# Altium schematic sheet Industrial Radio.SchDoc
size B; SheetNumber: 1; SheetTotal: 1
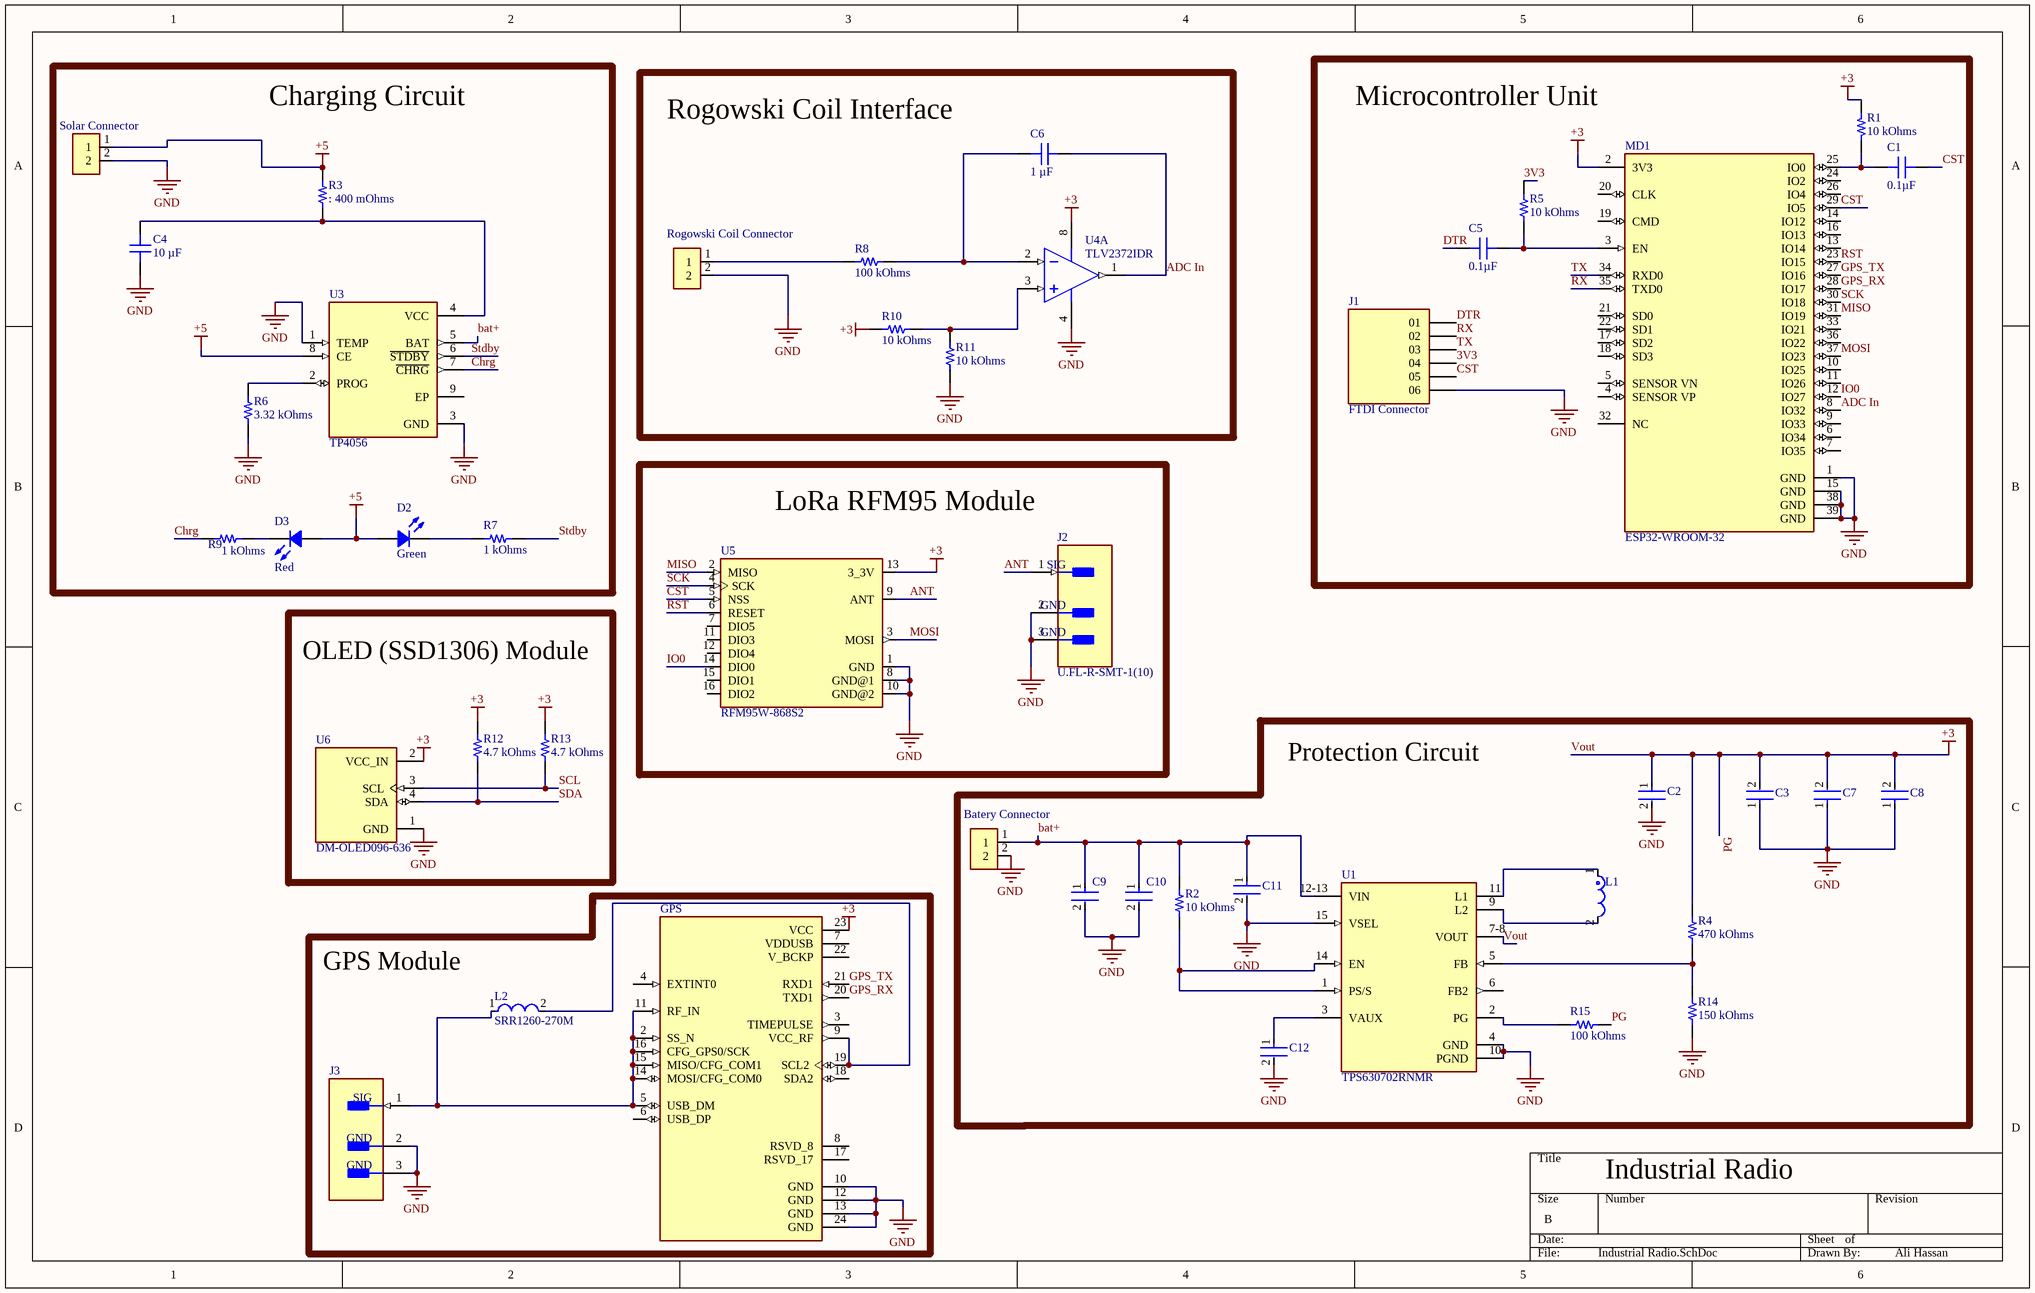
[diagram p0: Industrial Radio.SchDoc]

## Parts
Batery_Connector  B2B-PH-SM4-TB(LF)(SN)  [B2B-PH-SM4-TB(LF)(SN)]  (value not drawn)
C1  0.1µF  [CAP 0603_1608]
C2  TMK107BBJ106MA-T  [FP-0603-L_1_6_0_2-W_0_8_0-MFG]  (value not drawn)
C3  GRM21BC81C226ME44L  [FP-GRM21B-0_2-e0_2_0_7-MFG]  (value not drawn)
C4  10 µF  [MURATA GRM188 0603_1608]
C5  0.1µF  [CAP 0603_1608]
C6  1 µF  [CAP 0603_1608]
C7  GRM21BC81C226ME44L  [FP-GRM21B-0_2-e0_2_0_7-MFG]  (value not drawn)
C8  GRM21BC81C226ME44L  [FP-GRM21B-0_2-e0_2_0_7-MFG]  (value not drawn)
C9  GRM21BC71E106ME11L  [FP-GRM21B-0_2-e0_2_0_7-IPC_A]  (value not drawn)
C10  GRM21BC71E106ME11L  [FP-GRM21B-0_2-e0_2_0_7-IPC_A]  (value not drawn)
C11  TMK107BBJ106MA-T  [FP-0603-L_1_6_0_2-W_0_8_0-MFG]  (value not drawn)
C12  TMK105B7104MV-FR  [FP-0402-L_1_0_0_05-W_0_5-IPC_B]  (value not drawn)
D2  Green  [LED 1206_3216 GREEN]
D3  Red  [LED 1206_3216 RED]
GPS  NEO-6M-GPS  [XCVR_NEO-6M-GPS]  (value not drawn)
J1  FTDI Connector  [SAMTEC_MTSW-106-09-G-S-375-RA]
J2  U.FL-R-SMT-1(10)  [FP-U_FL-R-SMT-1_10-MFG]
J3  U.FL-R-SMT-1(10)  [FP-U_FL-R-SMT-1_10-MFG]  (value not drawn)
L1  XFL4020-152MEC  [FP-XFL4020-MFG]  (value not drawn)
L2  SRR1260-270M  [FP-SRR1260-MFG]
MD1  ESP32-WROOM-32  [FP-ESP32-WROOM-32-MFG]
R1  10 kOhms  [RES 0603_1608]
R2  10 kOhms  [RES 0603_1608]
R3  (no value)  [YAGEO RES 0603_1608]
R4  470 kOhms  [YAGEO RES 0603_1608]
R5  10 kOhms  [RES 0603_1608]
R6  3.32 kOhms  [RES 0603_1608]
R7  1 kOhms  [RES 0603_1608]
R8  100 kOhms  [RES 0603_1608]
R9  1 kOhms  [RES 0603_1608]
R10  10 kOhms  [RES 0603_1608]
R11  10 kOhms  [RES 0603_1608]
R12  4.7 kOhms  [RES 0603_1608]
R13  4.7 kOhms  [RES 0603_1608]
R14  150 kOhms  [RES 0603_1608]
R15  100 kOhms  [RES 0603_1608]
Rogowski_Coil_Connector  B2B-PH-SM4-TB(LF)(SN)  [B2B-PH-SM4-TB(LF)(SN)]  (value not drawn)
Solar_Connector  B2B-PH-SM4-TB(LF)(SN)  [B2B-PH-SM4-TB(LF)(SN)]  (value not drawn)
U1  TPS630702RNMR  [FP-RNM0015A-MFG]
U3  TP4056  [SOP127P600X175-9N]
U4  TLV2372IDR  [D0008A_M]  (part A of 2)
U5  RFM95W-868S2  [XCVR_RFM95W-868S2]
U6  DM-OLED096-636  [MODULE_DM-OLED096-636]

## Blocks framed on the sheet
Charging Circuit: C4 D2 D3 R3 R6 R7 R9 Solar_Connector U3
Microcontroller Unit: C1 C5 J1 MD1 R1 R5
Rogowski Coil Interface: C6 R8 R10 R11 Rogowski_Coil_Connector U4
LoRa RFM95 Module: J2 U5
OLED (SSD1306) Module: R12 R13 U6
Protection Circuit: Batery_Connector C2 C3 C7-C12 L1 R2 R4 R14 R15 U1

## Nets
+5: D2.1 D3.1 R3.2 Solar_Connector.1 U3.8(CE)
GND: Batery_Connector.2 C2.2 C3.1 C4.1 C7.1 C8.1 C9.2 C10.2 C11.2 C12.2 GPS.10(GND) GPS.12(GND) GPS.13(GND) GPS.24(GND) J1.06 J2.2(GND) J2.3(GND) J3.2(GND) J3.3(GND) MD1.1(GND) MD1.15(GND) MD1.38(GND) MD1.39(GND) R6.1 R11.1 R14.1 Rogowski_Coil_Connector.2 Solar_Connector.2 U1.4(GND) U1.10(PGND) U1.15(VSEL) U3.1(TEMP) U3.3(GND) U4.4(GND) U5.1(GND) U5.8(GND@1) U5.10(GND@2) U6.1(GND)
PG: C2.1 C3.2 C7.2 C8.2 GPS.23(VCC) MD1.2(3V3) R1.2 R4.2 R10.1 R12.1 R13.1 R15.1 U1.7-8(VOUT) U4.8(VDD) U5.13(3_3V) U6.2(VCC_IN)  [also labelled +3, Vout]
3V3: J1.04 R5.2
ADC In: C6.2 MD1.8(IO32) U4.1(OUT1)
ANT: J2.1(SIG) U5.9(ANT)
bat+: Batery_Connector.1 C9.1 C10.1 C11.1 R2.2 U1.12-13(VIN) U3.5(BAT)
Chrg: R9.1 U3.7(~{CHRG})
CST: C1.1 J1.05 MD1.29(IO5) U5.5(NSS)
DTR: C5.1 J1.01
GPS_RX: GPS.20(TXD1) MD1.28(IO17)
GPS_TX: GPS.21(RXD1) MD1.27(IO16)
IO0: MD1.12(IO27) U5.14(DIO0)
MISO: MD1.31(IO19) U5.2(MISO)
MOSI: MD1.37(IO23) U5.3(MOSI)
RST: MD1.23(IO15) U5.6(RESET)
RX: J1.02 MD1.35(TXD0)
SCK: MD1.30(IO18) U5.4(SCK)
SCL: R13.2 U6.3(SCL)
SDA: R12.2 U6.4(SDA)
Stdby: R7.1 U3.6(~{STDBY})
TX: J1.03 MD1.34(RXD0)
NetC1_2: C1.2 MD1.25(IO0) R1.1
NetC4_2: C4.2 R3.1 U3.4(VCC)
NetC5_2: C5.2 MD1.3(EN) R5.1
NetC6_1: C6.1 R8.2 U4.2(IN1-)
NetC12_1: C12.1 U1.3(VAUX)
NetD2_2: D2.2 R7.2
NetD3_2: D3.2 R9.2
NetGPS_2: GPS.2(SS_N) GPS.5(USB_DM) GPS.11(RF_IN) GPS.14(MOSI/CFG_COM0) GPS.15(MISO/CFG_COM1) GPS.16(CFG_GPS0/SCK) J3.1(SIG) L2.1
NetGPS_9: GPS.9(VCC_RF) GPS.19(SCL2) L2.2
NetL1_1: L1.1 U1.11(L1)
NetL1_2: L1.2 U1.9(L2)
NetR2_1: R2.1 U1.1(PS/S) U1.14(EN)
NetR4_1: R4.1 R14.2 U1.5(FB)
NetR6_2: R6.2 U3.2(PROG)
NetR8_1: R8.1 Rogowski_Coil_Connector.1
NetR10_2: R10.2 R11.2 U4.3(IN1+)
NetR15_2: R15.2 U1.2(PG)

Not connected (* = marked no-connect by the designer): GPS 3(TIMEPULSE) 4(EXTINT0) 6(USB_DP) 7(VDDUSB) 8(RSVD_8) 17(RSVD_17) 18(SDA2) 22(V_BCKP); MD1 4(SENSOR_VP) 5(SENSOR_VN) 6(IO34) 7(IO35) 9(IO33) 10(IO25) 11(IO26) 13(IO14) 14(IO12) 16(IO13) 17(SD2) 18(SD3) 19(CMD) 20(CLK) 21(SD0) 22(SD1) 24(IO2) 26(IO4) 32(NC) 33(IO21) 36(IO22); U1 6(FB2); U3 9(EP); U5 7(DIO5) 11(DIO3) 12(DIO4) 15(DIO1) 16(DIO2)

## Notes on the sheet
- (near L2) GPS Module
- Industrial Radio
- Ali Hassan

## Library data of the parts
Batery_Connector Rogowski_Coil_Connector Solar_Connector = B2B-PH-SM4-TB(LF)(SN): Connector Header Surface Mount 2 position 0.079 (2.00mm); MF: JST Sales; SnapEDA_Link: https://www.snapeda.com/parts/B2B-PH-SM4-TB(LF)(SN)/JST+Sales+America+Inc./view-part/?ref=snap; Package: NON STANDARD-2 JST; Value: *; MP: B2B-PH-SM4-TB(LF)(SN); Check_prices: https://www.snapeda.com/parts/B2B-PH-SM4-TB(LF)(SN)/JST+Sales+America+Inc./view-part/?ref=eda
C1 C5 = 06033C104K4T4A: CAP CER 0.1UF 25V X7R 0603; manufacturer: AVX Corporation; Tolerance: ±10%; Part Number: 06033C104K4T4A; Capacitance: 0.1µF; Applications: Automotive; componentlink1description: Datasheet; componentlink1url: http://datasheets.avx.com/AutoMLCC.pdf; componentlink2description: DigiKey Link; componentlink2url: http://digikey.com/product-detail/en/avx-corporation/06033C104K4T4A/478-10673-1-ND/7536544; Device Package: 0603 (1608 Metric); lastupdated: 02/09/2020 1:03:35 am; Lifecycle Status: Active; Minimum Order: 1; Mounting Type: Surface Mount, MLCC; Operating Temperature: -55°C ~ 125°C; Package / Case: 0603 (1608 Metric); packaging: TapeAndReel; partid: 2749; Part Status: Active; price: 0.02; Ratings: AEC-Q200; series: -; Size / Dimension: 0.063" L x 0.032" W (1.60mm x 0.81mm); Supplier 1: DigiKey; Supplier Part Number 1: 478-10673-1-ND; Temperature Coefficient: X7R; Thickness (Max): 0.035" (0.90mm); value: 0.1µF; Voltage - Rated: 25V
C2 C11 = CMP-14477-005164-2: Multilayer Ceramic Capacitor 10uF 25V X5R 20% SMD 0603 T/R; Capacitance: 10uF; Packaging: Tape and Reel; Tolerance: 20%; Mount: Surface Mount; Case Code (Metric): 1608; Case Code (Imperial): 0603; Min Operating Temperature: -55°C; Lead Free: Lead Free; RoHS Compliant: Yes; Case/Package: 0603; Max Operating Temperature: 85°C; Voltage Rating: 25V
C3 C7 C8 = CMP-06035-012913-1: Chip Multilayer Ceramic Capacitors for General Purpose, 0805, 22uF, X6S, 22%, 20%, 16V; Packaging: Tape and Reel; Dielectric: X6S; Case Code (Imperial): 0805; Weight: 0.000335oz; Case Code (Metric): 2012; Thickness: 0.057inch; Min Operating Temperature: -55°C; Voltage Rating (DC): 16V; Tolerance: 20%; Width: 1.25mm; Voltage Rating: 16V; Mount: Surface Mount; Capacitance: 22uF; Length: 0.079inch; Lead Free: Lead Free; Case/Package: 0805; Package Quantity: 3000; Height: 1.25mm; Max Operating Temperature: 105°C; Termination: SMD/SMT
C4 = GRM188C80E106ME47D: CAP CER 10UF 2.5V X6S 0603; manufacturer: Murata Electronics; Tolerance: ±20%; Part Number: GRM188C80E106ME47D; Capacitance: 10 µF; Applications: General Purpose; componentlink1description: Datasheet; componentlink1url: https://www.murata.com/~/media/webrenewal/support/library/catalog/products/capacitor/mlcc/c02e.ashx?la=en-us; componentlink2description: DigiKey Link; componentlink2url: https://www.digikey.com/en/products/detail/murata-electronics/GRM188C80E106ME47D/2612380; Device Package: 0603 (1608 Metric); lastupdated: 20/07/2024 12:23:22 am; Lifecycle Status: Active; Minimum Order: 1; Mounting Type: Surface Mount, MLCC; Operating Temperature: -55°C ~ 105°C; Package / Case: 0603 (1608 Metric); packaging: TapeAndReel; partid: 2395; Part Status: Active; price: 0.03; series: GRM; Size / Dimension: 0.063" L x 0.031" W (1.60mm x 0.80mm); Supplier 1: DigiKey; Supplier Part Number 1: 490-8278-1-ND; Temperature Coefficient: X6S; Thickness (Max): 0.035" (0.90mm); value: 10 µF; Voltage - Rated: 2.5V
C6 = C0603X105M9RACAUTO: CAP CER 1UF 6.3V X7R 0603; manufacturer: KEMET; Tolerance: ±20%; Part Number: C0603X105M9RACAUTO; Capacitance: 1 µF; Applications: Automotive, Boardflex Sensitive; componentlink1description: Datasheet; componentlink1url: https://api.kemet.com/component-edge/download/datasheet/C0603X105M9RACAUTO.pdf; componentlink2description: DigiKey Link; componentlink2url: https://www.digikey.com/en/products/detail/kemet/C0603X105M9RACAUTO/8635848; Device Package: 0603 (1608 Metric); Features: Soft Termination; lastupdated: 09/02/2024 8:10:30 pm; Lifecycle Status: Active; Minimum Order: 1; Mounting Type: Surface Mount, MLCC; Operating Temperature: -55°C ~ 125°C; Package / Case: 0603 (1608 Metric); packaging: TapeAndReel; partid: 2401; Part Status: Active; price: 0.06; Ratings: AEC-Q200; series: SMD Auto X7R Flex; Size / Dimension: 0.063" L x 0.031" W (1.60mm x 0.80mm); Supplier 1: DigiKey; Supplier Part Number 1: 399-17721-1-ND; Temperature Coefficient: X7R; Thickness (Max): 0.037" (0.95mm); value: 1 µF; Voltage - Rated: 6.3V
C9 C10 = CMP-06035-056773-1: Chip Multilayer Ceramic Capacitors for General Purpose, 0805, 10uF, X7S, 22%, 20%, 25V; Case/Package: 0805; Min Operating Temperature: -55°C; Packaging: Tape and Reel; Height: 1.25mm; Thickness: 0.057inch; Weight: 0.000335oz; Termination: SMD/SMT; Capacitance: 10uF; Max Operating Temperature: 125°C; Length: 0.079inch; Dielectric: X7S; Mount: Surface Mount; Voltage Rating (DC): 25V; Case Code (Imperial): 0805; Case Code (Metric): 2012; Voltage Rating: 25V; Tolerance: 20%; Package Quantity: 3000; Width: 0.049inch
C12 = CMP-14477-003834-2: None; Capacitance: 100nF; Voltage Rating: 25V; Tolerance: 20%; Min Operating Temperature: -55°C; Max Operating Temperature: 125°C; Mount: Surface Mount; RoHS Compliant: Yes; Case/Package: 0402; Packaging: Tape and Reel
D2 = HSMQ-C380: LED GREEN SMD; Manufacturer: Broadcom Limited; Configuration: Standard; Current - Test: 20mA; Lens Color: 1.95mm; Lens Size: 1.40mm Dia; Lens Style: Round with Domed Top; Viewing Angle: 15°; Voltage - Forward (Vf) (Typ): 3.4V; Wavelength - Dominant: 528nm; Wavelength - Peak: 521nm; Part Number: HSMQ-C380; Color: Green; ComponentLink1Description: Datasheet; ComponentLink1URL: https://docs.broadcom.com/docs/12380614; ComponentLink2Description: DigiKey Link; ComponentLink2URL: https://www.digikey.com/en/products/detail/broadcom-limited/HSMQ-C380/8509698; Device Package: 1206 (3216 Metric); Height (Max): 1.95mm; LastUpdated: 03/06/2024 7:59:11 pm; Lifecycle Status: Active; Minimum Order: 1; Mounting Type: Surface Mount; Package / Case: 1206 (3216 Metric); Packaging: TapeAndReel; PartId: 567; Part Status: Active; Price: 0.48; Series: -; Size / Dimension: 3.20mm L x 1.60mm W; Supplier 1: DigiKey; Supplier Part Number 1: 516-4361-1-ND; Value: Green
D3 = HSMC-C380: LED RED SMD; Manufacturer: Broadcom Limited; Configuration: Standard; Current - Test: 20mA; Lens Color: 1.95mm; Lens Size: 1.40mm Dia; Lens Style: Round with Domed Top; Viewing Angle: 15°; Voltage - Forward (Vf) (Typ): 2V; Wavelength - Dominant: 630nm; Wavelength - Peak: 643nm; Part Number: HSMC-C380; Color: Red; ComponentLink1Description: Datasheet; ComponentLink1URL: https://docs.broadcom.com/docs/HSMC-C380-DS100; ComponentLink2Description: DigiKey Link; ComponentLink2URL: https://www.digikey.com/en/products/detail/broadcom-limited/HSMC-C380/8509679; Device Package: 1206 (3216 Metric); Height (Max): 1.95mm; LastUpdated: 03/06/2024 8:00:41 pm; Lifecycle Status: Active; Minimum Order: 1; Mounting Type: Surface Mount; Package / Case: 1206 (3216 Metric); Packaging: TapeAndReel; PartId: 196; Part Status: Active; Price: 0.23; Series: -; Size / Dimension: 3.20mm L x 1.60mm W; Supplier 1: DigiKey; Supplier Part Number 1: 516-HSMC-C380CT-ND; Value: Red
GPS = NEO-6M-GPS: GPS Development Tools SparkFun GNSS-RTK Dead Reckoning Breakout - ZED-F9K (Qwiic); MF: u-blox; SnapEDA_Link: https://www.snapeda.com/parts/NEO-6M-GPS/u-blox/view-part/?ref=snap; MP: NEO-6M-GPS; Availability: Not in stock; Price: None; Check_prices: https://www.snapeda.com/parts/NEO-6M-GPS/u-blox/view-part/?ref=eda; Value: *; Package: None
J1 = MTSW-106-09-G-S-375-RA: Connector Header Through Hole, Right Angle 6 position 0.100 (2.54mm); MF: Samtec Inc.; SnapEDA_Link: https://www.snapeda.com/parts/MTSW-106-09-G-S-375-RA/Samtec/view-part/?ref=snap; Package: None; Value: *; MP: MTSW-106-09-G-S-375-RA; Check_prices: https://www.snapeda.com/parts/MTSW-106-09-G-S-375-RA/Samtec/view-part/?ref=eda
J2 J3 = CMP-2000-05152-3: CONN U.FL RCPT STR 50 OHM SMD; Max Frequency: 6GHz; Connector Type: Coaxial; Body Plating: Silver; Body Material: Bronze; Impedance: 50R; Dielectric Material: Polymer; Insulation Resistance: 500MR; Gender: Male; Packaging: Cut Tape; Length: 3mm; Package Quantity: 2500; Termination: Solder; Lead Free: Lead Free; Series: U.FL; Min Operating Temperature: -40°C; Fastening Type: Snap; Contact Material: Brass; Orientation: Straight; Wire/Cable Type: Coaxial; Frequency: 6GHz; Contact Plating: Gold; Depth: 3.1mm; Weight: 0.001764oz; Max Operating Temperature: 90°C; Radiation Hardening: No; REACH SVHC: No SVHC; Mount: Surface Mount; Housing Color: Beige
L1 = CMP-11268-000104-1: Inductor Power Shielded Wirewound 1.5uH 20% 100KHz 9.1A 15.8mOhm DCR 1515 Automotive Embossed Plastic T/R; Core Material: Composite; DC Resistance (DCR): 15.8mR; Saturation Current: 4.1A; Self Resonant Frequency: 59MHz; Tolerance: 20%; Inductance: 1.5uH; Max DC Current: 9.1A; RoHS Compliant: Yes; Max Operating Temperature: 125°C; Length: 4.3mm; Case/Package: SMD/SMT; Mount: Surface Mount; Shielding: Shielded; Min Operating Temperature: -40°C; RMS Current (Irms): 9.1A; Test Frequency: 100kHz; Inductance Tolerance: 20%; REACH SVHC: No SVHC; Packaging: Tape and Reel; Termination: SMD/SMT; Lead Free: Contains Lead; Width: 4.3mm; Series: XFL4020; Height: 2.1mm
L2 = CMP-07248-000018-1: FIXED IND 27UH 3.6A 45 MOHM SMD; Manufacturer: Bourns; Tolerance: 20%; Core Material: Ferrite; Q Factor: 26; Series Resistance: 45mΩ; Saturation Current: 3.3A; Self Resonant Frequency: 12.7MHz; Test Frequency: 2.52MHz; ComponentLink2URL: https://www.bourns.com/docs/product-datasheets/srr1260.pdf?sfvrsn=a4409aa5_15; Mouser Description: Fixed Inductors 27uH 20% SMD 1260; Temperature Range Low: -40°C; Manufacturer Part Number: SRR1260-270M; Temperature Range High: +125°C; ComponentLink2Description: Datasheet; Lead Free: Yes; Device Class L1: Passive Components; Value: 27uH; Height: 6.5mm; Rms Current: 3.6A; Category: Ind; Device Class L2: Inductors; Composition: Wirewound; RoHS: TRUE; Automotive: No; Digikey Description: FIXED IND 27UH 3.6A 45 MOHM SMD; Package: SRR1260; Device Class L3: Fixed Inductors; Inductance: 27uH; Octopart: https://octopart.com/srr1260-270m-bourns-1930921; Temperature: -40°C to +125°C
MD1 = CMP-194065-000008-1: RX TXRX MOD WIFI SURFACE MOUNT; Frequency: 2.5GHz; Sensitivity: -98dBm; Operating Supply Voltage: 3.6V; Data Rate: 150Mbps; Weight: 0.088185oz; Package Quantity: 550; Min Operating Temperature: -40°C; Mount: Surface Mount; Max Operating Temperature: 85°C; Packaging: Cut Tape; Case/Package: SMD/SMT
R1 R5 R10 R11 = CRCW060310K0JNEA: RES SMD 10K OHM 5% 1/10W 0603; Manufacturer: Vishay Dale; Power (Watts): 0.1W, 1/10W; Temperature Coefficient: ±200ppm/°C; Part Number: CRCW060310K0JNEA; Value: 10 kOhms; ComponentLink1Description: Datasheet; ComponentLink1URL: http://www.vishay.com/docs/20035/dcrcwe3.pdf; ComponentLink2Description: DigiKey Link; ComponentLink2URL: https://www.digikey.com/en/products/detail/vishay-dale/CRCW060310K0JNEA/1174253; Composition: Thick Film; Device Package: 0603 (1608 Metric); Features: Automotive AEC-Q200; Height - Seated (Max): 0.020" (0.50mm); LastUpdated: 09/02/2024 8:43:35 pm; Lifecycle Status: Active; Minimum Order: 1; Number of Terminations: 2; Operating Temperature: -55°C ~ 155°C; Package / Case: 0603 (1608 Metric); Packaging: CutTape; PartId: 5216; Part Status: Active; Price: 0.01; Ratings: AEC-Q200; Resistance: 10 kOhms; Series: CRCW; Size / Dimension: 0.063" L x 0.033" W (1.60mm x 0.85mm); Supplier 1: DigiKey; Supplier Part Number 1: 541-10KGCT-ND; Supplier Device Package: 0603; Tolerance: ±5%
R2 = RNCS0603BKE10K0: RES 10K OHM 0.1% 1/16W 0603; Manufacturer: Stackpole Electronics Inc; Power (Watts): 0.063W, 1/16W; Temperature Coefficient: ±25ppm/°C; Part Number: RNCS0603BKE10K0; Value: 10 kOhms; ComponentLink1Description: Datasheet; ComponentLink1URL: https://www.seielect.com/catalog/sei-rncs_rnch.pdf; ComponentLink2Description: DigiKey Link; ComponentLink2URL: https://www.digikey.com/en/products/detail/stackpole-electronics-inc/RNCS0603BKE10K0/1708836; Composition: Thin Film; Device Package: 0603 (1608 Metric); Features: Anti-Corrosive, Automotive AEC-Q200, Moisture Resistant; Height - Seated (Max): 0.022" (0.55mm); LastUpdated: 09/02/2024 8:43:37 pm; Lifecycle Status: Active; Minimum Order: 1; Number of Terminations: 2; Operating Temperature: -55°C ~ 155°C; Package / Case: 0603 (1608 Metric); Packaging: TapeAndReel; PartId: 4838; Part Status: Active; Price: 0.06; Ratings: AEC-Q200; Resistance: 10 kOhms; Series: RNCS; Size / Dimension: 0.061" L x 0.031" W (1.55mm x 0.80mm); Supplier 1: DigiKey; Supplier Part Number 1: RNCS0603BKE10K0CT-ND; Supplier Device Package: 0603; Tolerance: ±0.1%
R3 = RL0603FR-070R4L: RES 0.4 OHM 1% 1/10W 0603; Manufacturer: Yageo; Power (Watts): 0.1W, 1/10W; Resistance: 400 mOhms; Temperature Coefficient: ±800ppm/°C; Part Number: RL0603FR-070R4L; ComponentLink1Description: Datasheet; ComponentLink1URL: http://www.yageo.com/documents/recent/PYu-RL_Group_521_RoHS_L_2.pdf; ComponentLink2Description: DigiKey Link; ComponentLink2URL: https://www.digikey.com/en/products/detail/yageo/RL0603FR-070R4L/3885512; Composition: Thick Film; Device Package: 0603 (1608 Metric); Features: Current Sense; Height - Seated (Max): 0.022" (0.55mm); LastUpdated: 25/07/2024 9:19:17 am; Lifecycle Status: Active; Minimum Order: 1; Number of Terminations: 2; Operating Temperature: -55°C ~ 155°C; Package / Case: 0603 (1608 Metric); Packaging: TapeAndReel; PartId: 24886; Part Status: Active; Price: 0.03; Ratings: AEC-Q200; Series: RL; Size / Dimension: 0.063" L x 0.031" W (1.60mm x 0.80mm); Supplier 1: DigiKey; Supplier Part Number 1: 311-.4QCT-ND; Supplier Device Package: 0603; Tolerance: ±1%
R4 = AC0603JR-07470KL: RES SMD 470K OHM 5% 1/10W 0603; Manufacturer: Yageo; Power (Watts): 0.1W, 1/10W; Temperature Coefficient: ±100ppm/°C; Part Number: AC0603JR-07470KL; Value: 470 kOhms; ComponentLink1Description: Datasheet; ComponentLink1URL: https://www.yageo.com/upload/media/product/productsearch/datasheet/rchip/PYu-AC_51_RoHS_L_7.pdf; ComponentLink2Description: DigiKey Link; ComponentLink2URL: https://www.digikey.com/en/products/detail/yageo/AC0603JR-07470KL/5896462; Composition: Thick Film; Device Package: 0603 (1608 Metric); Features: Automotive AEC-Q200, Moisture Resistant; Height - Seated (Max): 0.022" (0.55mm); LastUpdated: 25/07/2024 9:19:32 am; Lifecycle Status: Active; Minimum Order: 1; Number of Terminations: 2; Operating Temperature: -55°C ~ 155°C; Package / Case: 0603 (1608 Metric); Packaging: CutTape; PartId: 5238; Part Status: Active; Price: 0.01; Ratings: AEC-Q200; Resistance: 470 kOhms; Series: AC; Size / Dimension: 0.063" L x 0.031" W (1.60mm x 0.80mm); Supplier 1: DigiKey; Supplier Part Number 1: YAG3672CT-ND; Supplier Device Package: 0603; Tolerance: ±5%
R6 = ERJ-PB3B3321V: RES SMD 3.32K OHM 0.1% 1/5W 0603; Manufacturer: Panasonic Electronic Components; Power (Watts): 0.2W, 1/5W; Temperature Coefficient: ±50ppm/°C; Part Number: ERJ-PB3B3321V; Value: 3.32 kOhms; ComponentLink1Description: Datasheet; ComponentLink1URL: https://industrial.panasonic.com/cdbs/www-data/pdf/RDM0000/AOA0000C328.pdf; ComponentLink2Description: DigiKey Link; ComponentLink2URL: https://www.digikey.com/en/products/detail/panasonic-electronic-components/ERJ-PB3B3321V/6212813; Composition: Thick Film; Device Package: 0603 (1608 Metric); Features: Automotive AEC-Q200, Pulse Withstanding; Height - Seated (Max): 0.022" (0.55mm); LastUpdated: 09/02/2024 8:43:36 pm; Lifecycle Status: Active; Minimum Order: 1; Number of Terminations: 2; Operating Temperature: -55°C ~ 155°C; Package / Case: 0603 (1608 Metric); Packaging: TapeAndReel; PartId: 4916; Part Status: Active; Price: 0.02; Ratings: AEC-Q200; Resistance: 3.32 kOhms; Series: ERJ-PB3; Size / Dimension: 0.063" L x 0.031" W (1.60mm x 0.80mm); Supplier 1: DigiKey; Supplier Part Number 1: P20030CT-ND; Supplier Device Package: 0603; Tolerance: ±0.1%
R7 R9 = CPF0603B1K0E: RES SMD 1K OHM 0.1% 1/16W 0603; Manufacturer: TE Connectivity Passive Product; Power (Watts): 0.063W, 1/16W; Temperature Coefficient: ±25ppm/°C; Part Number: CPF0603B1K0E; Value: 1 kOhms; ComponentLink1Description: Datasheet; ComponentLink1URL: https://www.te.com/commerce/DocumentDelivery/DDEController?Action=srchrtrv&DocNm=1773200&DocType=DS&DocLang=English; ComponentLink2Description: DigiKey Link; ComponentLink2URL: https://www.digikey.com/en/products/detail/te-connectivity-passive-product/CPF0603B1K0E/2390473; Composition: Thin Film; Device Package: 0603 (1608 Metric); Height - Seated (Max): 0.022" (0.55mm); LastUpdated: 09/02/2024 8:43:37 pm; Lifecycle Status: Active; Minimum Order: 1; Number of Terminations: 2; Operating Temperature: -55°C ~ 155°C; Package / Case: 0603 (1608 Metric); Packaging: TapeAndReel; PartId: 4877; Part Status: Active; Price: 0.09; Resistance: 1 kOhms; Series: CPF, Neohm; Size / Dimension: 0.061" L x 0.031" W (1.55mm x 0.80mm); Supplier 1: DigiKey; Supplier Part Number 1: A119887CT-ND; Supplier Device Package: 0603; Tolerance: ±0.1%
R8 R15 = RNCS0603BKE100K: RES 100K OHM 0.1% 1/16W 0603; Manufacturer: Stackpole Electronics Inc; Power (Watts): 0.063W, 1/16W; Temperature Coefficient: ±25ppm/°C; Part Number: RNCS0603BKE100K; Value: 100 kOhms; ComponentLink1Description: Datasheet; ComponentLink1URL: https://www.seielect.com/catalog/sei-rncs_rnch.pdf; ComponentLink2Description: DigiKey Link; ComponentLink2URL: https://www.digikey.com/en/products/detail/stackpole-electronics-inc/RNCS0603BKE100K/1708835; Composition: Thin Film; Device Package: 0603 (1608 Metric); Features: Anti-Corrosive, Automotive AEC-Q200, Moisture Resistant; Height - Seated (Max): 0.022" (0.55mm); LastUpdated: 09/02/2024 8:43:37 pm; Lifecycle Status: Active; Minimum Order: 1; Number of Terminations: 2; Operating Temperature: -55°C ~ 155°C; Package / Case: 0603 (1608 Metric); Packaging: TapeAndReel; PartId: 4849; Part Status: Active; Price: 0.06; Ratings: AEC-Q200; Resistance: 100 kOhms; Series: RNCS; Size / Dimension: 0.061" L x 0.031" W (1.55mm x 0.80mm); Supplier 1: DigiKey; Supplier Part Number 1: RNCS0603BKE100KCT-ND; Supplier Device Package: 0603; Tolerance: ±0.1%
R12 R13 = ERA-3AEB472V: RES SMD 4.7K OHM 0.1% 1/10W 0603; Manufacturer: Panasonic Electronic Components; Power (Watts): 0.1W, 1/10W; Temperature Coefficient: ±25ppm/°C; Part Number: ERA-3AEB472V; Value: 4.7 kOhms; ComponentLink1Description: Datasheet; ComponentLink1URL: https://industrial.panasonic.com/cdbs/www-data/pdf/RDM0000/AOA0000C307.pdf; ComponentLink2Description: DigiKey Link; ComponentLink2URL: https://www.digikey.com/en/products/detail/panasonic-electronic-components/ERA-3AEB472V/1465870; Composition: Thin Film; Device Package: 0603 (1608 Metric); Features: Automotive AEC-Q200; Height - Seated (Max): 0.022" (0.55mm); LastUpdated: 09/02/2024 8:43:34 pm; Lifecycle Status: Active; Minimum Order: 1; Number of Terminations: 2; Operating Temperature: -55°C ~ 155°C; Package / Case: 0603 (1608 Metric); Packaging: TapeAndReel; PartId: 5519; Part Status: Active; Price: 0.03; Ratings: AEC-Q200; Resistance: 4.7 kOhms; Series: ERA-3A; Size / Dimension: 0.063" L x 0.031" W (1.60mm x 0.80mm); Supplier 1: DigiKey; Supplier Part Number 1: P4.7KDBCT-ND; Supplier Device Package: 0603; Tolerance: ±0.1%
R14 = CRGP0603F150K: RES 150K OHM 1% 1/4W 0603; Manufacturer: TE Connectivity Passive Product; Power (Watts): 0.25W, 1/4W; Temperature Coefficient: ±100ppm/°C; Part Number: CRGP0603F150K; Value: 150 kOhms; ComponentLink1Description: Datasheet; ComponentLink1URL: https://www.te.com/commerce/DocumentDelivery/DDEController?Action=srchrtrv&DocNm=9-1773463-9&DocType=DS&DocLang=English; ComponentLink2Description: DigiKey Link; ComponentLink2URL: https://www.digikey.com/en/products/detail/te-connectivity-passive-product/CRGP0603F150K/8577044; Composition: Thick Film; Device Package: 0603 (1608 Metric); Features: Pulse Withstanding; Height - Seated (Max): 0.022" (0.55mm); LastUpdated: 09/02/2024 8:43:36 pm; Lifecycle Status: Active; Minimum Order: 1; Number of Terminations: 2; Operating Temperature: -55°C ~ 155°C; Package / Case: 0603 (1608 Metric); Packaging: TapeAndReel; PartId: 5042; Part Status: Active; Price: 0.02; Resistance: 150 kOhms; Series: CRGP; Size / Dimension: 0.063" L x 0.031" W (1.60mm x 0.80mm); Supplier 1: DigiKey; Supplier Part Number 1: A130442CT-ND; Supplier Device Package: 0603; Tolerance: ±1%
U1 = CMP-04918-000193-1: POWER MANAGEMENT
U3 = TP4056: Complete single cell Li-Ion battery with a constant current / constant voltage linear charger; MF: NanJing Top Power ASIC Corp.; Check_prices: https://www.snapeda.com/parts/TP4056/NanJing+Top+Power+ASIC+Corp./view-part/?ref=eda; SnapEDA_Link: https://www.snapeda.com/parts/TP4056/NanJing+Top+Power+ASIC+Corp./view-part/?ref=snap; Price: None; Availability: Not in stock; Package: Package; MP: TP4056; Value: *
U4 = CMP-0272-02948-3: 550 uA/Ch, 3 MHz, RRIO Operational Amplifier, 2.7 to 16 V, -40 to 125 degC, 8-pin SOIC (D8), Green (RoHS & no Sb/Br); Manufacturer: Texas Instruments; GBW(Typ)(MHz): 3; Offset Drift(Typ)(uV/C): 2; Total Supply Voltage(Max)(+5V is 5, +/-5V is 10): 16; Vio (25C)(Max)(mV): 4.5; Iq per channel(Max)(mA): 0.9; Packing: LARGE T&R; Sub Family: Low Supply Voltage Amplifier (<=2.7V), Precision Amplifier; IIB(Max)(pA): 60; Rating: Catalog; CMRR(Min)(dB): 50; Total Supply Voltage(Min)(+5V is 5, +/-5V is 10): 2.7; Slew Rate(Typ)(V/us): 2.4; ComponentLink1URL: http://www.ti.com/; ComponentLink2Description: Datasheet; PartNumber: TLV2372IDR; Code_JEDEC: MS-012; PackageDescription: 8-Pin Plastic Small Outline, Body 4.9 x 3.9 mm, Pitch 1.27 mm; ComponentLink1Description: Manufacturer URL; DatasheetVersion: SLOS270D; ComponentLink3Description: Package Specification; ComponentLink2URL: http://www.ti.com/lit/ds/symlink/tlv2372.pdf; ComponentLink3URL: http://www.ti.com/litv/pdf/msoi002j; Mounting Technology: Surface Mount; PackageVersion: 4040047-3/M, 06/2011; Eco-Plan: Green (RoHS & no Sb/Br); Number of Channels: 2; PackageReference: D0008A
U5 = RFM95W-868S2: General ISM < 1GHz LoRaâ„¢ Transceiver Module 868MHz Antenna Not Included Surface Mount; MF: RF; Package: Non Standard RF Solutions; Price: None; Check_prices: https://www.snapeda.com/parts/RFM95W-868S2/RF+Solutions/view-part/?ref=eda; Value: *; SnapEDA_Link: https://www.snapeda.com/parts/RFM95W-868S2/RF+Solutions/view-part/?ref=snap; MP: RFM95W-868S2; Availability: In Stock; Purchase-URL: https://pricing.snapeda.com/search?q=RFM95W-868S2&ref=eda
U6 = DM-OLED096-636: 0.96â€ 128 X 64 MONOCHROME GRAPHIC OLED DISPLAY MODULE - I2C; SnapEDA_Link: https://www.snapeda.com/parts/DM-OLED096-636/Display+Module/view-part/?ref=snap; Package: Package; Value: *; MF: Display Module; MP: DM-OLED096-636; Check_prices: https://www.snapeda.com/parts/DM-OLED096-636/Display+Module/view-part/?ref=eda